# Altium schematic sheet RFEv2_1.SchDoc
size A3
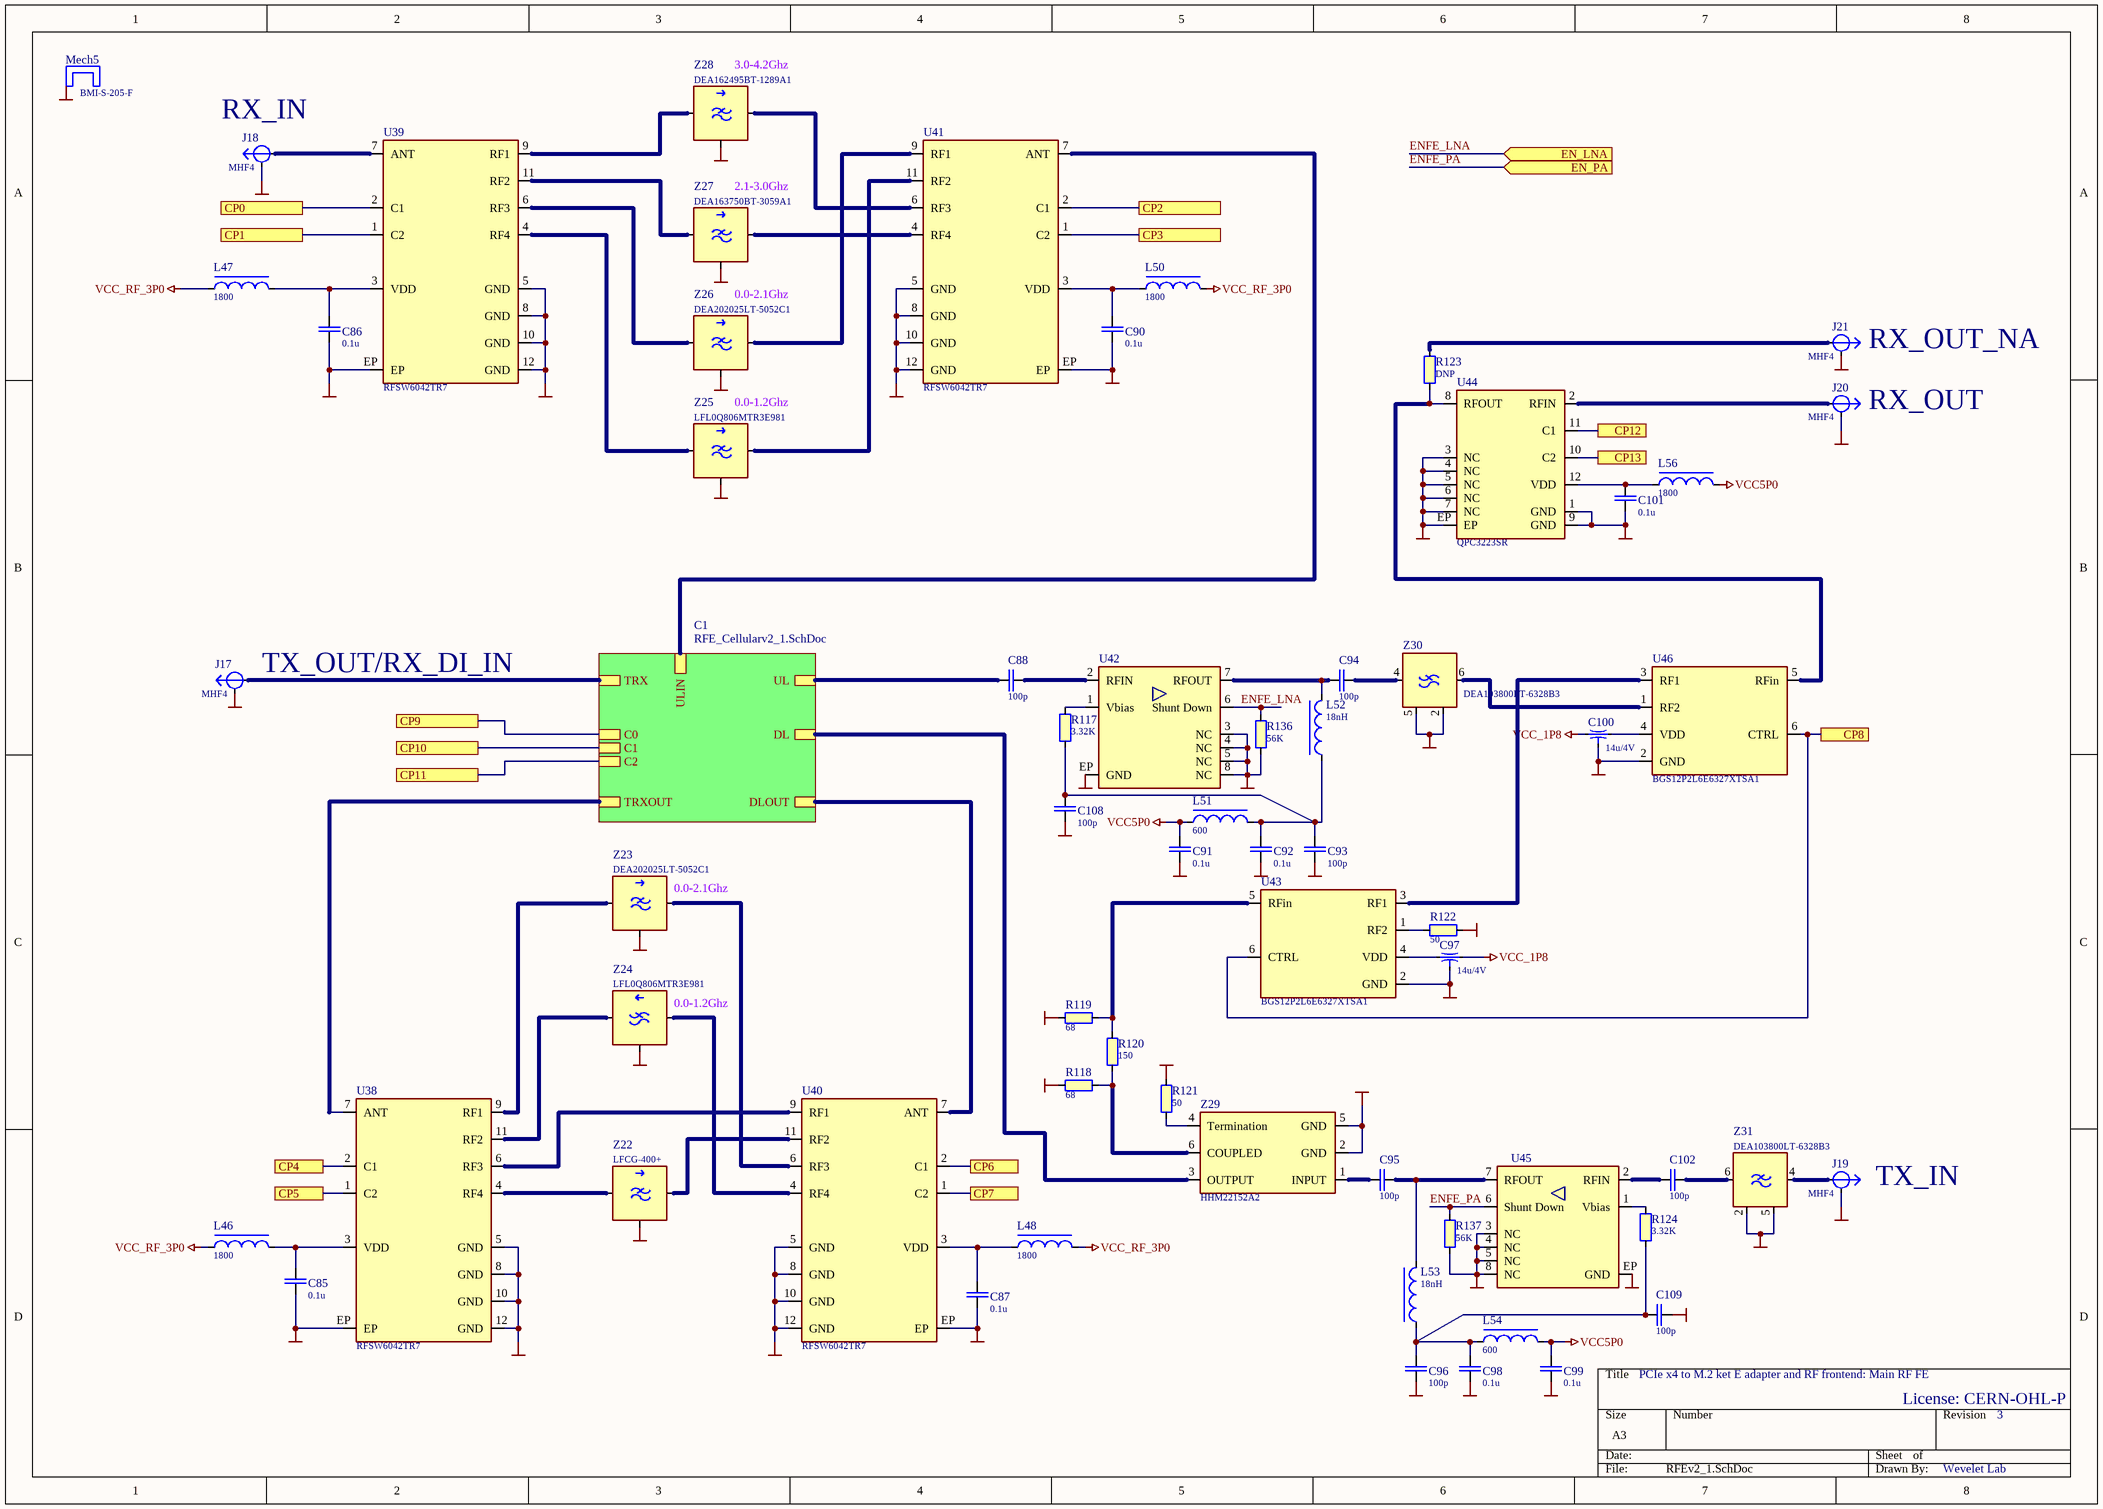
[diagram p0: RFEv2_1.SchDoc]

## Parts
C85  value 0.1u  [CAPC100X50X55L25N]  (hidden comment: GRM155R71E104KE14D)
C86  value 0.1u  [CAPC100X50X55L25N]  (hidden comment: GRM155R71E104KE14D)
C87  value 0.1u  [CAPC100X50X55L25N]  (hidden comment: GRM155R71E104KE14D)
C88  value 100p  [CAPC100X50X55L25N]  (hidden comment: Cap-0402-NP0-50V-100p-20%)
C90  value 0.1u  [CAPC100X50X55L25N]  (hidden comment: GRM155R71E104KE14D)
C91  value 0.1u  [CAPC100X50X55L25N]  (hidden comment: GRM155R71E104KE14D)
C92  value 0.1u  [CAPC100X50X55L25N]  (hidden comment: GRM155R71E104KE14D)
C93  value 100p  [CAPC100X50X55L25N]  (hidden comment: Cap-0402-NP0-50V-100p-20%)
C94  value 100p  [CAPC100X50X55L25N]  (hidden comment: Cap-0402-NP0-50V-100p-20%)
C95  value 100p  [CAPC100X50X55L25N]  (hidden comment: Cap-0402-NP0-50V-100p-20%)
C96  value 100p  [CAPC100X50X55L25N]  (hidden comment: Cap-0402-NP0-50V-100p-20%)
C97  value 14u/4V  [CAPCEMI100X50X50L20N]  (hidden comment: NFM15PC146R0G3D)
C98  value 0.1u  [CAPC100X50X55L25N]  (hidden comment: GRM155R71E104KE14D)
C99  value 0.1u  [CAPC100X50X55L25N]  (hidden comment: GRM155R71E104KE14D)
C100  value 14u/4V  [CAPCEMI100X50X50L20N]  (hidden comment: NFM15PC146R0G3D)
C101  value 0.1u  [CAPC100X50X55L25N]  (hidden comment: GRM155R71E104KE14D)
C102  value 100p  [CAPC100X50X55L25N]  (hidden comment: Cap-0402-NP0-50V-100p-20%)
C108  value 100p  [CAPC100X50X55L25N]  (hidden comment: Cap-0402-NP0-50V-100p-20%)
C109  value 100p  [CAPC100X50X55L25N]  (hidden comment: Cap-0402-NP0-50V-100p-20%)
J17  value MHF4  [LINX_CONMHF4-SMD-G-T]  (hidden comment: CONMHF4-SMD-G-T)
J18  value MHF4  [LINX_CONMHF4-SMD-G-T]  (hidden comment: CONMHF4-SMD-G-T)
J19  value MHF4  [LINX_CONMHF4-SMD-G-T]  (hidden comment: CONMHF4-SMD-G-T)
J20  value MHF4  [LINX_CONMHF4-SMD-G-T]  (hidden comment: CONMHF4-SMD-G-T)
J21  value MHF4  [LINX_CONMHF4-SMD-G-T]  (hidden comment: CONMHF4-SMD-G-T)
L46  value 1800  [INDC100X60X60L30N]  (hidden comment: BLM15HD182SN1D)
L47  value 1800  [INDC100X60X60L30N]  (hidden comment: BLM15HD182SN1D)
L48  value 1800  [INDC100X60X60L30N]  (hidden comment: BLM15HD182SN1D)
L50  value 1800  [INDC100X60X60L30N]  (hidden comment: BLM15HD182SN1D)
L51  value 600  [INDC100X60X60L30N]  (hidden comment: BLM15HG601SN1D)
L52  value 18nH  [CAPC100X50X55L25N]  (hidden comment: MLK1005S18NJT000)
L53  value 18nH  [CAPC100X50X55L25N]  (hidden comment: MLK1005S18NJT000)
L54  value 600  [INDC100X60X60L30N]  (hidden comment: BLM15HG601SN1D)
L56  value 1800  [INDC100X60X60L30N]  (hidden comment: BLM15HD182SN1D)
Mech5  BMI-S-205-F  [LAIRD_BMI-S-205]
R117  value 3.32K  [RESC100X50X40L20N]  (hidden comment: RC0402FR-073K32L)
R118  value 68  [RESC100X50X40L20N]  (hidden comment: RC0402FR-0768RL)
R119  value 68  [RESC100X50X40L20N]  (hidden comment: RC0402FR-0768RL)
R120  value 150  [RESC100X50X40L20N]  (hidden comment: RC0402FR-07150RL)
R121  value 50  [RESC100X50X40L20N]  (hidden comment: RC0402FR-0750RL)
R122  value 50  [RESC100X50X40L20N]  (hidden comment: RC0402FR-0750RL)
R123  value DNP  [RESC100X50X40L20N]  (hidden comment: Res-0402-DNP)  (no BOM)
R124  value 3.32K  [RESC100X50X40L20N]  (hidden comment: RC0402FR-073K32L)
R136  value 56K  [RESC100X50X40L20N]  (hidden comment: RC0402FR-0756KL)
R137  value 56K  [RESC100X50X40L20N]  (hidden comment: RC0402FR-0756KL)
U38  RFSW6042TR7  [QFN13P40_180X180X60L25X18T80N]
U39  RFSW6042TR7  [QFN13P40_180X180X60L25X18T80N]
U40  RFSW6042TR7  [QFN13P40_180X180X60L25X18T80N]
U41  RFSW6042TR7  [QFN13P40_180X180X60L25X18T80N]
U42  QPL9547TR7  [SON9P50_200X200X100L30X25T160X80N]
U43  BGS12P2L6E6327XTSA1  [PSON6P40_110X70X32L20X20N]
U44  QPC3223SR  [QFN13P50_300X300X90L50X23T120N]
U45  QPL9547TR7  [SON9P50_200X200X100L30X25T160X80N]
U46  BGS12P2L6E6327XTSA1  [PSON6P40_110X70X32L20X20N]
Z22  LFCG-400+  [Mini-Circuits_ GE0805C-2]
Z23  DEA202025LT-5052C1  [TDK_DEA202025LT-5052C1]
Z24  LFL0Q806MTR3E981  [MURATA_LFL0Q806MTR3E981]
Z25  LFL0Q806MTR3E981  [MURATA_LFL0Q806MTR3E981]
Z26  DEA202025LT-5052C1  [TDK_DEA202025LT-5052C1]
Z27  DEA163750BT-3059A1  [TDK_DEA163750BT-3059A1]
Z28  DEA162495BT-1289A1  [TDK_DEA162495BT-1289A1]
Z29  HHM22152A2  [TDK_HHM22152A2]
Z30  DEA103800LT-6328B3  [TDK_DEA10-L]
Z31  DEA103800LT-6328B3  [TDK_DEA10-L]

## Sub-sheets
C1 = RFE_Cellularv2_1.SchDoc: TRX, UL, DL, C0, C1, C2, ULIN, DLOUT, TRXOUT

## Ports
CP0, CP1, CP2, CP3, CP4, CP5, CP6, CP7, CP8, CP9, CP10, CP11, CP12, CP13, EN_LNA (in), EN_PA (in)

## Nets
GND: C85.2 C86.2 C87.2 C90.2 C91.2 C92.2 C93.1 C96.1 C97.2(GND) C98.2 C99.2 C100.2(GND) C101.2 C108.1 C109.1 J17.SH J18.SH J19.SH J20.SH J21.SH Mech5.SH R118.1 R119.1 R121.2 R122.2 R136.1 R137.1 U38.5(GND) U38.8(GND) U38.10(GND) U38.12(GND) U38.EP U39.5(GND) U39.8(GND) U39.10(GND) U39.12(GND) U39.EP U40.5(GND) U40.8(GND) U40.10(GND) U40.12(GND) U40.EP U41.5(GND) U41.8(GND) U41.10(GND) U41.12(GND) U41.EP U42.3(NC) U42.4(NC) U42.5(NC) U42.8(NC) U42.EP(GND) U43.2(GND) U44.1(GND) U44.3(NC) U44.4(NC) U44.5(NC) U44.6(NC) U44.7(NC) U44.9(GND) U44.EP U45.3(NC) U45.4(NC) U45.5(NC) U45.8(NC) U45.EP(GND) U46.2(GND) Z22.2 Z23.2 Z24.3 Z25.3 Z26.2 Z27.2 Z28.2 Z29.2(GND) Z29.5(GND) Z30.2 Z30.5 Z31.2 Z31.5
VCC5P0: C91.1 C99.1 L51.2 L54.2 L56.1
VCC_1P8: C97.1 C100.1
VCC_RF_3P0: L46.1 L47.1 L48.2 L50.2
CP0: U39.2(C1) ; port CP0
CP1: U39.1(C2) ; port CP1
CP2: U41.2(C1) ; port CP2
CP3: U41.1(C2) ; port CP3
CP4: U38.2(C1) ; port CP4
CP5: U38.1(C2) ; port CP5
CP6: U40.2(C1) ; port CP6
CP7: U40.1(C2) ; port CP7
CP8: U43.6(CTRL) U46.6(CTRL) ; port CP8
CP9: port CP9, sheet C1/C0
CP10: port CP10, sheet C1/C1
CP11: port CP11, sheet C1/C2
CP12: U44.11(C1) ; port CP12
CP13: U44.10(C2) ; port CP13
ENFE_LNA: R136.2 U42.6(Shunt_Down) ; port EN_LNA
ENFE_PA: R137.2 U45.6(Shunt_Down) ; port EN_PA
NetC85_1: C85.1 L46.2 U38.3(VDD)
NetC86_1: C86.1 L47.2 U39.3(VDD)
NetC87_1: C87.1 L48.1 U40.3(VDD)
NetC88_1: C88.1 ; sheet C1/UL
NetC88_2: C88.2 U42.2(RFIN)
NetC90_1: C90.1 L50.1 U41.3(VDD)
NetC92_1: C92.1 C93.2 C108.2 L51.1 L52.1 R117.1
NetC94_1: C94.1 L52.2 U42.7(RFOUT)
NetC94_2: C94.2 Z30.4
NetC95_1: C95.1 Z29.1(INPUT)
NetC95_2: C95.2 L53.2 U45.7(RFOUT)
NetC96_2: C96.2 C98.1 C109.2 L53.1 L54.1 R124.2
NetC97_3: C97.3 U43.4(VDD)
NetC100_3: C100.3 U46.4(VDD)
NetC101_1: C101.1 L56.2 U44.12(VDD)
NetC102_1: C102.1 U45.2(RFIN)
NetC102_2: C102.2 Z31.6
NetJ17_1: J17.1 ; sheet C1/TRX
NetJ18_1: J18.1 U39.7(ANT)
NetJ19_1: J19.1 Z31.4
NetJ20_1: J20.1 U44.2(RFIN)
NetJ21_1: J21.1 R123.1
NetR117_2: R117.2 U42.1(Vbias)
NetR118_2: R118.2 R120.2 Z29.6(COUPLED)
NetR119_2: R119.2 R120.1 U43.5(RFin)
NetR121_1: R121.1 Z29.4(Termination)
NetR122_1: R122.1 U43.1(RF2)
NetR123_2: R123.2 U44.8(RFOUT) U46.5(RFin)
NetR124_1: R124.1 U45.1(Vbias)
NetU38_4: U38.4(RF4) Z22.1
NetU38_6: U38.6(RF3) U40.9(RF1)
NetU38_7: U38.7(ANT) ; sheet C1/TRXOUT
NetU38_9: U38.9(RF1) Z23.1
NetU38_11: U38.11(RF2) Z24.1
NetU39_4: U39.4(RF4) Z25.2
NetU39_6: U39.6(RF3) Z26.1
NetU39_9: U39.9(RF1) Z28.1
NetU39_11: U39.11(RF2) Z27.1
NetU40_4: U40.4(RF4) Z24.2
NetU40_6: U40.6(RF3) Z23.3
NetU40_7: U40.7(ANT) ; sheet C1/DLOUT
NetU40_11: U40.11(RF2) Z22.3
NetU41_4: U41.4(RF4) Z27.3
NetU41_6: U41.6(RF3) Z28.3
NetU41_7: U41.7(ANT) ; sheet C1/ULIN
NetU41_9: U41.9(RF1) Z26.3
NetU41_11: U41.11(RF2) Z25.1
NetU43_3: U43.3(RF1) U46.3(RF1)
NetU46_1: U46.1(RF2) Z30.6
NetZ29_3: Z29.3(OUTPUT) ; sheet C1/DL

## Notes on the sheet
- (near Z28) 3.0-4.2Ghz
- (near J18) RX_IN
- 2.1-3.0Ghz
- 0.0-2.1Ghz
- (near J21) RX_OUT_NA
- 0.0-1.2Ghz
- RX_OUT
- (near J17) TX_OUT/RX_DI_IN
- (near Z23) 0.0-2.1Ghz
- (near Z24) 0.0-1.2Ghz
- (near J19) TX_IN
- PCIe x4 to M.2 ket E adapter and RF frontend: Main RF FE
- License: CERN-OHL-P
- 3
- Wevelet Lab

## Library data of the parts
C85-C87 C90-C92 C98 C99 C101 = GRM155R71E104KE14D: Capacitor, 0.1u, 25V, 10%, X7R, 0402; Manufacturer: Murata Electronics
C88 C93-C96 C102 C108 C109 = Cap-0402-NP0-50V-100p-20%: Capacitor, 100p, 50V, 20%, NP0, 0402; Manufacturer: *
C97 C100 = NFM15PC146R0G3D: Capacitor feedthru, 14u, 4V, 20%, 2A, 0402; Manufacturer: Murata Electronics; Name: NFM15PC146R0G3D
J17-J21 = CONMHF4-SMD-G-T: Conn, IPEX MHF4, Male Pin, 50 Ohm, -65/+165, SMD; Manufacturer: Linx Technologies Inc.; Name: CONMHF4-SMD-G-T
L46-L48 L50 L56 = BLM15HD182SN1D: Ferrite bead, 1800Ohm@100MHz, 0,2A, 2.2Ohm, -55/+125, SMD0402; Manufacturer: Murata Electronics; Name: BLM15HD182SN1D
L51 L54 = BLM15HG601SN1D: Ferrite bead, 600Ohm@100MHz, 0,3A, 700mOhm, -55/+125, SMD0402; Manufacturer: Murata Electronics; Name: BLM15HG601SN1D
L52 L53 = MLK1005S18NJT000: Inductor, 18n, -55/+125, SMD0402; Manufacturer: TDK; Name: MLK1005S18NJT000
Mech5 = BMI-S-205-F: EMI Gaskets, Sheets, Absorbers & Shielding; Manufacturer: Laird Performance Materials; Value: BMI-S-205-F
R117 R124 = Res-0402-3.32K-1%: Resistor, 3.32K, 0.063W, 1%, 0402; Manufacturer: *; Name: RC0402FR-073K32L
R118 R119 = Res-0402-68-5%: Resistor, 68, 0.063W, 5%, 0402; Manufacturer: *; Name: RC0402FR-0768RL
R120 = Res-0402-150-5%: Resistor, 150, 0.063W, 5%, 0402; Manufacturer: *; Name: RC0402FR-07150RL
R121 R122 = Res-0402-50-5%: Resistor, 50, 0.063W, 5%, 0402; Manufacturer: *; Name: RC0402FR-0750RL
R123 = Res-0402-DNP: Resistor, DNP, 0.063W, 5%, 0402; Manufacturer: *
R136 R137 = Res-0402-56K-5%: Resistor, 56K, 0.063W, 5%, 0402; Manufacturer: *; Name: RC0402FR-0756KL
U38-U41 = RFSW6042: IC, Switch, SP4T, 5-6000MHz, -40/+85, / 12-QFN; Manufacturer: Qorvo; Value: RFSW6042TR7
U42 U45 = QPL9547: IC, 0.1 -6 GHz Ultra Low-Noise LNA, SON-8; Manufacturer: QORVO; Value: QPL9547TR7
U43 U46 = BGS12P2L6E6327XTSA1: IC, RF switch, SPDT, 50Ohm -40/+85, TSLP-6-4; Manufacturer: Infineon Technologies; Value: BGS12P2L6E6327XTSA1
U44 = QPC3223: IC, Digital step attenuator, -40/+105, QFN-12; Manufacturer: QORVO; Value: QPC3223SR
Z22 = LFCG-400+: Filter Low Pass, 50Ohm, 400MHz, 30dB, -55/+125, SMD; Manufacturer: Mini-Circuits; Value: LFCG-400+
Z23 Z26 = DEA202025LT-5052C1: RF FILTER, 1880-2023MHZ  -40/+85, 0805; Manufacturer: TDK Corporation; Value: DEA202025LT-5052C1
Z24 Z25 = LFL0Q806MTR3E981: RF FILTER, 0-1200MHZ  -40/+85, Smd; Manufacturer: Murata Electronics; Value: LFL0Q806MTR3E981
Z27 = DEA163750BT-3059A1: RF FILTER, 3300-4200MHZ  -40/+85, 0603; Manufacturer: TDK Corporation; Value: DEA163750BT-3059A1
Z28 = DEA162495BT-1289A1: RF FILTER, 2300-2690MHZ  -40/+85, 0603; Manufacturer: TDK Corporation; Value: DEA162495BT-1289A1
Z29 = HHM22152A2: Signal Coupler, 450-3800MHz, -40/+105, SMD; Manufacturer: TDK; Value: HHM22152A2
Z30 Z31 = DEA103800LT-6328B3: Filter Low Pass, 2.25GHz, 4.6dB, -40/+85, SMD; Manufacturer: TDK Corporation; Value: DEA103800LT-6328B3